# Altium project DM3390_R0M0E0.PrjPcb (part 3 of 5)

## Sheet DM3390_IMU.SchDoc: =project_title
size Tabloid; CompanyName: Luxonis Holding; DrawnBy: David Malovrh; Organization: Luxonis Holding; Address1: 1925 Harmony Park Drive; Address2: Westminster, CO; Address3: 80234; Address4: United States; DocumentNumber: D0000190; SheetNumber: 11; SheetTotal: 11
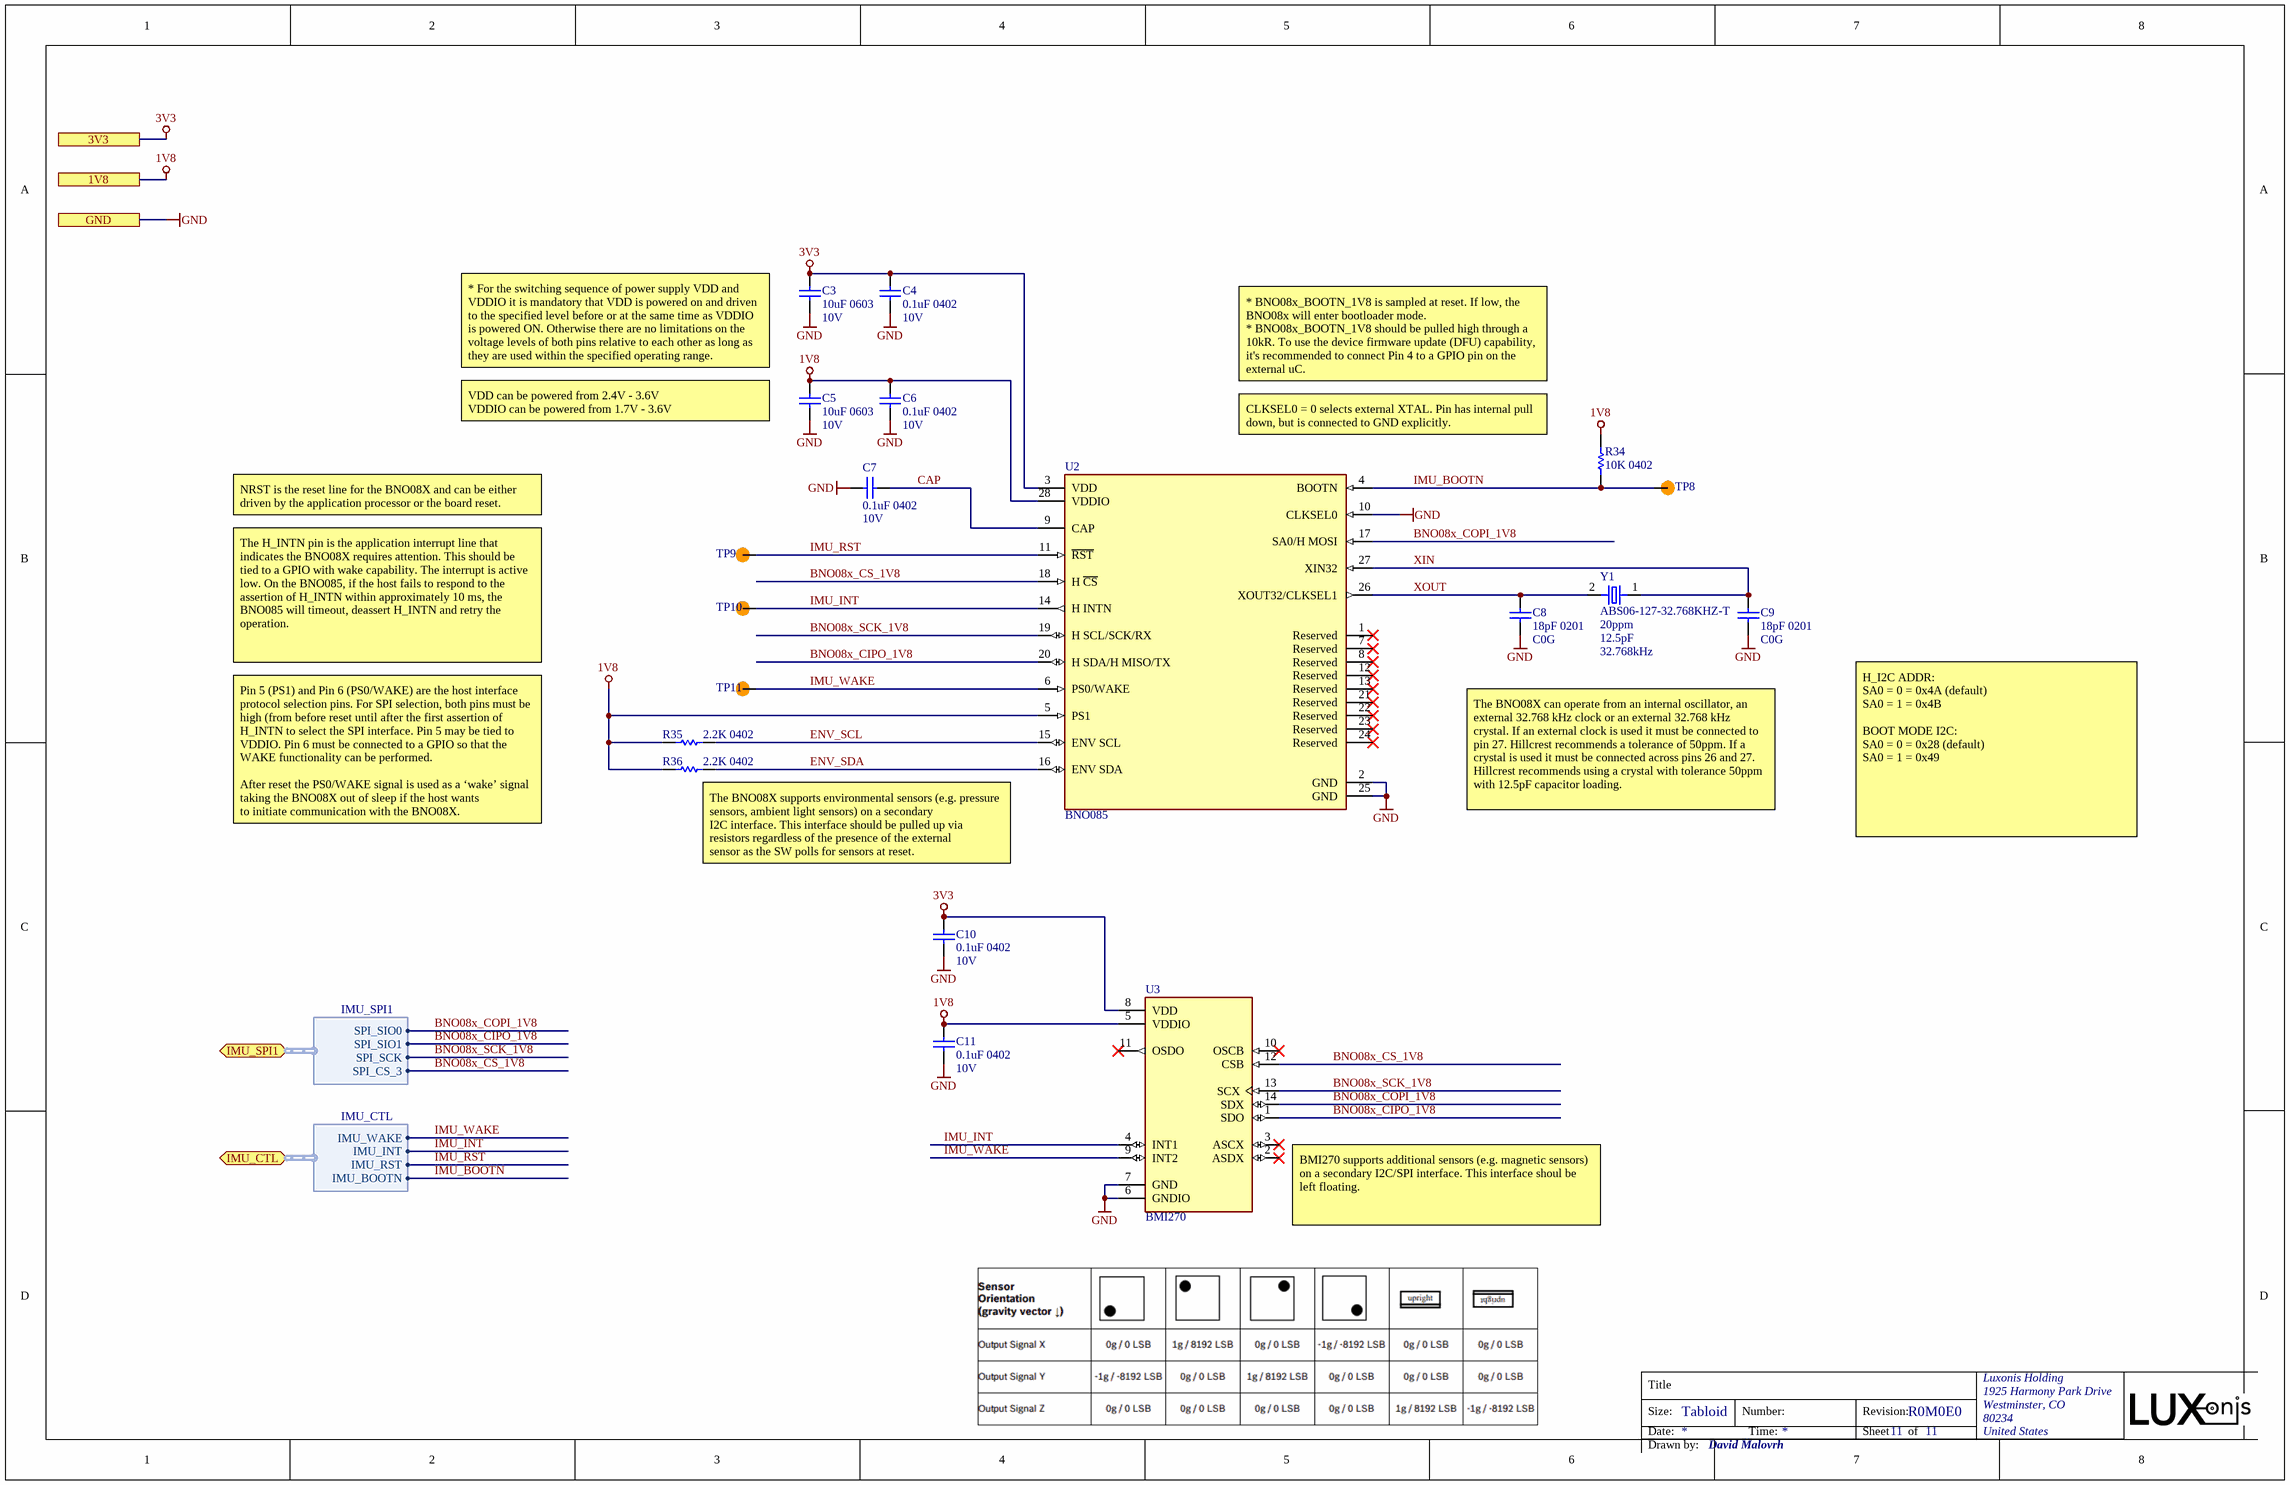
[diagram p4: DM3390_IMU.SchDoc]

### Parts
C3  10uF 0603  Voltage Rating: 10V  [CAPC0603(1608)100_L]
C4  0.1uF 0402  Voltage Rating: 10V  [CAPC0402(1005)70_L]
C5  10uF 0603  Voltage Rating: 10V  [CAPC0603(1608)100_L]
C6  0.1uF 0402  Voltage Rating: 10V  [CAPC0402(1005)70_L]
C7  0.1uF 0402  Voltage Rating: 10V  [CAPC0402(1005)70_L]
C8  18pF 0201  Dielectric: C0G  [CAPC0201(0603)33_L]
C9  18pF 0201  Dielectric: C0G  [CAPC0201(0603)33_L]
C10  0.1uF 0402  Voltage Rating: 10V  [CAPC0402(1005)70_L]
C11  0.1uF 0402  Voltage Rating: 10V  [CAPC0402(1005)70_L]
R34  10K 0402  [RESC0402(1005)_L]
R35  2.2K 0402  [RESC0402(1005)_L]
R36  2.2K 0402  [RESC0402(1005)_L]
TP8  TP100_200_NS  [TP100_200_NS]  (value not drawn)  (no BOM)
TP9  TP100_200_NS  [TP100_200_NS]  (value not drawn)  (no BOM)
TP10  TP100_200_NS  [TP100_200_NS]  (value not drawn)  (no BOM)
TP11  TP100_200_NS  [TP100_200_NS]  (value not drawn)  (no BOM)
U2  BNO085  [BNO085]
U3  BMI270  [XDCR_BMI270]
Y1  ABS06-127-32.768KHZ-T  Frequency Tolerance: 20ppm  Load Capacitance: 12.5pF  Frequency: 32.768kHz  [ABS06-127-32.768KHZ-T]

### Ports
1V8, 3V3, GND, IMU_CTL (bidir, harness IMU_CTL), IMU_SPI1 (bidir, harness IMU_SPI1)

### Harnesses
IMU_SPI1: SPI_SIO0, SPI_SIO1, SPI_CS_3, SPI_SCK
IMU_CTL: IMU_WAKE, IMU_INT, IMU_RST, IMU_BOOTN

### Nets
1V8: C5.2 C6.2 C11.2 R34.2 R35.1 R36.1 U2.5(PS1) U2.28(VDDIO) U3.5(VDDIO) ; port 1V8
3V3: C3.2 C4.2 C10.2 U2.3(VDD) U3.8(VDD) ; port 3V3
GND: C3.1 C4.1 C5.1 C6.1 C7.2 C8.1 C9.1 C10.1 C11.1 U2.2(GND) U2.10(CLKSEL0) U2.25(GND) U3.6(GNDIO) U3.7(GND) ; port GND
BNO08x_CIPO_1V8: U2.20(H_SDA/H_MISO/TX) U3.1(SDO) ; port IMU_SPI1.SPI_SIO1
BNO08x_COPI_1V8: U2.17(SA0/H_MOSI) U3.14(SDX) ; port IMU_SPI1.SPI_SIO0
BNO08x_CS_1V8: U2.18(H_~{CS}) U3.12(CSB) ; port IMU_SPI1.SPI_CS_3
BNO08x_SCK_1V8: U2.19(H_SCL/SCK/RX) U3.13(SCX) ; port IMU_SPI1.SPI_SCK
CAP: C7.1 U2.9(CAP)
ENV_SCL: R35.2 U2.15(ENV_SCL)
ENV_SDA: R36.2 U2.16(ENV_SDA)
IMU_BOOTN: R34.1 TP8.1 U2.4(BOOTN) ; port IMU_CTL.IMU_BOOTN
IMU_INT: TP10.1 U2.14(H_INTN) U3.4(INT1) ; port IMU_CTL.IMU_INT
IMU_RST: TP9.1 U2.11(~{RST}) ; port IMU_CTL.IMU_RST
IMU_WAKE: TP11.1 U2.6(PS0/WAKE) U3.9(INT2) ; port IMU_CTL.IMU_WAKE
XIN: C9.2 U2.27(XIN32) Y1.1
XOUT: C8.2 U2.26(XOUT32/CLKSEL1) Y1.2

Not connected (* = marked no-connect by the designer): U2 1(Reserved)* 7(Reserved)* 8(Reserved)* 12(Reserved)* 13(Reserved)* 21(Reserved)* 22(Reserved)* 23(Reserved)* 24(Reserved)*; U3 2(ASDX)* 3(ASCX)* 10(OSCB)* 11(OSDO)*

### Notes on the sheet
- * For the switching sequence of power supply VDD and VDDIO it is mandatory that VDD is powered on and driven to the specified level before or at the same time as VDDIO is powered ON. Otherwise there are no limitations on the voltage levels of both pins relative to each other as long as they are used within the specified operating range.
- (near C5) VDD can be powered from 2.4V - 3.6V
  VDDIO can be powered from 1.7V - 3.6V
- * BNO08x_BOOTN_1V8 is sampled at reset. If low, the BNO08x will enter bootloader mode.
  * BNO08x_BOOTN_1V8 should be pulled high through a 10kR. To use the device firmware update (DFU) capability, it's recommended to connect Pin 4 to a GPIO pin on the external uC.
- CLKSEL0 = 0 selects external XTAL. Pin has internal pull down, but is connected to GND explicitly.
- NRST is the reset line for the BNO08X and can be either driven by the application processor or the board reset.
- The H_INTN pin is the application interrupt line that indicates the BNO08X requires attention. This should be tied to a GPIO with wake capability. The interrupt is active low. On the BNO085, if the host fails to respond to the assertion of H_INTN within approximately 10 ms, the BNO085 will timeout, deassert H_INTN and retry the operation.
- Pin 5 (PS1) and Pin 6 (PS0/WAKE) are the host interface protocol selection pins. For SPI selection, both pins must be high (from before reset until after the first assertion of H_INTN to select the SPI interface. Pin 5 may be tied to VDDIO. Pin 6 must be connected to a GPIO so that the WAKE functionality can be performed.
  After reset the PS0/WAKE signal is used as a ‘wake’ signal taking the BNO08X out of sleep if the host wants
  to initiate communication with the BNO08X.
- The BNO08X can operate from an internal oscillator, an external 32.768 kHz clock or an external 32.768 kHz crystal. If an external clock is used it must be connected to pin 27. Hillcrest recommends a tolerance of 50ppm. If a crystal is used it must be connected across pins 26 and 27. Hillcrest recommends using a crystal with tolerance 50ppm with 12.5pF capacitor loading.
- H_I2C ADDR:
  SA0 = 0 = 0x4A (default)
  SA0 = 1 = 0x4B
  BOOT MODE I2C:
  SA0 = 0 = 0x28 (default)
  SA0 = 1 = 0x49
- (near R36) The BNO08X supports environmental sensors (e.g. pressure sensors, ambient light sensors) on a secondary
  I2C interface. This interface should be pulled up via resistors regardless of the presence of the external
  sensor as the SW polls for sensors at reset.
- (near U3) BMI270 supports additional sensors (e.g. magnetic sensors) on a secondary I2C/SPI interface. This interface shoul be left floating.
- Title
- Size:
- Date:
- Tabloid
- Number:
- Time:
- Revision:
- Sheet
- of
- Drawn by:

### Library data of the parts
C3 C5 = GRM188R61A106ME69D: CAP CER 10UF 10V X5R 0603 20%; Manufacturer 1: Murata; Material: Ceramic; Supplier 1: Digi-Key; Manufacturer Part Number 1: GRM188R61A106ME69D; Stock 1: 2873098; Pricing 1: 1=0.21000, 10=0.14100, 100=0.07130, 500=0.04876, 1000=0.04313 (USD); RoHS: Yes; Mount: Surface Mount; Case/Package: 0603; Weight: 0.000222oz; Case Code (Metric): 1608; Case Code (Imperial): 0603; Min Operating Temperature: -55°C; Max Operating Temperature: 85°C; Packaging: Tape and Reel; Tolerance: 20%; Capacitance: 10uF; Dielectric: X5R; Voltage Rating (DC): 10V; Package Quantity: 4000; Termination: SMD/SMT; Length: 1.6mm; Height: 0.8mm; Width: 0.8mm; Thickness: 0.035inch; Depth: 0.8mm; REACH SVHC: Unknown; Lead Free: Lead Free; ComponentLink1URL: http://www.mouser.com/ds/2/281/c02e-2905.pdf?src-supplier=Mouser; ComponentLink1Description: http://www.mouser.com/ds/2/281/c02e-2905.pdf?src-supplier=Mouser; ComponentLink2URL: http://components.arrow.com/part/dataview/0323_06119472?src-supplier=Arrow+Europe; ComponentLink2Description: http://components.arrow.com/part/dataview/0323_06119472?src-supplier=Arrow+Europe; ComponentLink3URL: http://www.farnell.com/datasheets/2048014.pdf?src-supplier=Farnell; ComponentLink3Description: http://www.farnell.com/datasheets/2048014.pdf?src-supplier=Farnell; ComponentLink4URL: http://www.farnell.com/datasheets/1872210.pdf?src-supplier=Farnell; ComponentLink4Description: http://www.farnell.com/datasheets/1872210.pdf?src-supplier=Farnell; ComponentLink5URL: http://search.murata.co.jp/Ceramy/image/img/A01X/G101/ENG/GRM188R61A106ME69-01.pdf?src-supplier=Digi-Key; ComponentLink5Description: http://search.murata.co.jp/Ceramy/image/img/A01X/G101/ENG/GRM188R61A106ME69-01.pdf?src-supplier=Digi-Key; ComponentLink6URL: http://www.farnell.com/datasheets/1872210.pdf?src-supplier=Newark; ComponentLink6Description: http://www.farnell.com/datasheets/1872210.pdf?src-supplier=Newark; ComponentLink7URL: http://www.farnell.com/datasheets/2048014.pdf?src-supplier=Element14; ComponentLink7Description: http://www.farnell.com/datasheets/2048014.pdf?src-supplier=Element14; ComponentLink8URL: http://www.farnell.com/datasheets/2048014.pdf?src-supplier=Newark; ComponentLink8Description: http://www.farnell.com/datasheets/2048014.pdf?src-supplier=Newark; Supplier Part Number 1: 490-10475-1-ND
C4 C6 C7 C10 C11 = GRM155R71A104JA01D: CAP CER 0.1UF 10V X7R 0402 5%; Manufacturer 1: Murata; Capacitance: 100nF; Supplier 1: Digi-Key; Manufacturer Part Number 1: GRM155R71A104JA01D; Stock 1: 1346709; Pricing 1: 1=0.10000, 10=0.02500, 100=0.01130, 500=0.00806, 1000=0.00633, 2500=0.00575, 5000=0.00529 (USD); RoHS: Yes; Mount: Surface Mount; Case/Package: 0402; Case Code (Imperial): 0402; Case Code (Metric): 1005; Min Operating Temperature: -55°C; Max Operating Temperature: 125°C; Tolerance: 5%; Packaging: Tape and Reel; Voltage Rating (DC): 10V; Dielectric: X7R; Package Quantity: 10000; Termination: SMD/SMT; Length: 1mm; Height: 0.5mm; Width: 0.02inch; Thickness: 0.022inch; Depth: 0.5mm; Radiation Hardening: No; Lead Free: Lead Free; ComponentLink1URL: https://datasheet.ciiva.com/5411/product-5411135.pdf?src-supplier=Mouser; ComponentLink1Description: https://datasheet.ciiva.com/5411/product-5411135.pdf?src-supplier=Mouser; ComponentLink2URL: https://datasheet.ciiva.com/11618/c02e-11618821.pdf?src-supplier=Avnet; ComponentLink2Description: https://datasheet.ciiva.com/11618/c02e-11618821.pdf?src-supplier=Avnet; Supplier Part Number 1: 490-10777-1-ND
C8 C9 = GRM0335C1E180FA01D: Cap Ceramic 18pF 25V C0G 1% Pad SMD 0201 125C T/R; Manufacturer 1: Murata; Supplier 1: Digi-Key; Manufacturer Part Number 1: GRM0335C1E180FA01D; RoHS: Yes; Category: Ceramic Capacitors; Stock 1: 27511; Pricing 1: 1=0.10000, 10=0.02100, 100=0.00930, 500=0.00666, 1000=0.00523, 2500=0.00476, 5000=0.00438 (USD); Mount: Surface Mount; Case/Package: 0201; Case Code (Imperial): 0201; Case Code (Metric): 0603; Min Operating Temperature: -55°C; Max Operating Temperature: 125°C; Capacitance: 18pF; Tolerance: 1%; Packaging: Tape and Reel; Voltage Rating (DC): 25V; Package Quantity: 15000; Voltage Rating: 25V; Termination: SMD/SMT; Length: 0.024inch; Height: 0.3mm; Thickness: 0.013inch; Width: 0.3mm; ComponentLink1URL: https://datasheet.ciiva.com/29538/partnumbering-e-01-29538328.pdf?src-supplier=Digi-Key; ComponentLink1Description: https://datasheet.ciiva.com/29538/partnumbering-e-01-29538328.pdf?src-supplier=Digi-Key; Supplier 2: Digi-Key; Supplier 3: Mouser; Supplier Part Number 3: 81-GRM0335C1E180FA1D; Supplier Part Number 2: 490-17804-2-ND; Supplier Part Number 1: 490-17804-1-ND
R34 = RC0402FR-1310KL: RES SMD 10K OHM 1% 0402 1/16W Chip Resistor, 0402 [1005 Metric], 10 kohm, RC Series, 50 V, Thick Film, 62.5 mW; Manufacturer 1: Yageo; Resistance: 10kR; Temperature Coefficient: 100ppm/°C; Power Rating: 62.5mW; Voltage Rating: 50V; ComponentLink1URL: https://datasheet.ciiva.com/16940/pyu-rc0402-51-rohs-l-6-16940293.pdf?src-supplier=Avnet+Europe; ComponentLink1Description: https://datasheet.ciiva.com/16940/pyu-rc0402-51-rohs-l-6-16940293.pdf?src-supplier=Avnet+Europe; ComponentLink2URL: https://datasheet.ciiva.com/28386/pyu-rc0402-51-rohs-l-6-28386855.pdf?src-supplier=Avnet+Europe; ComponentLink2Description: https://datasheet.ciiva.com/28386/pyu-rc0402-51-rohs-l-6-28386855.pdf?src-supplier=Avnet+Europe; ComponentLink3URL: https://datasheet.ciiva.com/16740/pyu-rc0402-51-rohs-l-6-r-16740602.pdf?src-supplier=Future+Electronics; ComponentLink3Description: https://datasheet.ciiva.com/16740/pyu-rc0402-51-rohs-l-6-r-16740602.pdf?src-supplier=Future+Electronics; ComponentLink4URL: https://datasheet.ciiva.com/8891/pyu-rc0402-51-rohs-l-6-8891339.pdf?src-supplier=Avnet; ComponentLink4Description: https://datasheet.ciiva.com/8891/pyu-rc0402-51-rohs-l-6-8891339.pdf?src-supplier=Avnet; ComponentLink5URL: https://datasheet.ciiva.com/5557/pyu-rc0402-51-rohs-l-6-r-5557997.pdf?src-supplier=Mouser; ComponentLink5Description: https://datasheet.ciiva.com/5557/pyu-rc0402-51-rohs-l-6-r-5557997.pdf?src-supplier=Mouser; ComponentLink6URL: https://datasheet.ciiva.com/7983/1018594-7983533.pdf?src-supplier=Element14; ComponentLink6Description: https://datasheet.ciiva.com/7983/1018594-7983533.pdf?src-supplier=Element14; Supplier 1: Newark; Manufacturer Part Number 1: RC0402FR-1310KL; Stock 1: 62239; Pricing 1: 1=0.10000, 25=0.01200, 100=0.00400, 250=0.00400, 500=0.00300, 1000=0.00300 (USD); RoHS: Yes; Case/Package: 0402; Number of Pins: 2; Contact Plating: Tin,Matte,Lead; Case Code (Imperial): 0402; Case Code (Metric): 1005; Min Operating Temperature: -55°C; Max Operating Temperature: 155°C; Tolerance: 1%; Composition: Thick Film; Packaging: Tape and Reel; Termination: SMD/SMT; Military Standard: Not; Voltage Rating (DC): 50V; Working Voltage: 50V; Number of Terminations: 2; Length: 1mm; Depth: 0.5mm; Radiation Hardening: No; REACH SVHC: No SVHC; Lead Free: Lead Free; Supplier Part Number 1: 67R9960; Supplier 2: Future Electronics; Supplier 3: Mouser; Supplier 4: Element14; Supplier Part Number 2: RC0402FR-1310KL-CUTT; Supplier Part Number 3: 603-RC0402FR-1310KL; Supplier Part Number 4: 1799235
R35 R36 = RC0402FR-072K2L: RES SMD 2.2K OHM 1% 1/16W 0402; Manufacturer 1: Yageo; Resistance: 2.2kR; Temperature Coefficient: 100ppm/°C; Power Rating: 63mW; Voltage Rating: 50V; Supplier 1: Digi-Key; Manufacturer Part Number 1: RC0402FR-072K2L; Stock 1: 12579098; Pricing 1: 1=0.10000, 10=0.01600, 100=0.00640, 1000=0.00289, 2500=0.00251, 5000=0.00207 (USD); RoHS: Yes; Case/Package: 0402; Weight: 2.3E-05oz; Case Code (Imperial): 0402; Case Code (Metric): 1005; Min Operating Temperature: -55°C; Max Operating Temperature: 155°C; Packaging: Tape and Reel; Tolerance: 1%; Composition: Thick Film; Termination: SMD/SMT; Military Standard: Not; Length: 1mm; Height: 0.35mm; Width: 0.5mm; Depth: 0.5mm; Lead Free: Lead Free; REACH SVHC: Unknown; ComponentLink1URL: https://datasheet.ciiva.com/11808/0900766b80c66297-11808786.pdf?src-supplier=RSComponents; ComponentLink1Description: https://datasheet.ciiva.com/11808/0900766b80c66297-11808786.pdf?src-supplier=RSComponents; ComponentLink2URL: https://datasheet.ciiva.com/12577/pyu-rc0402-51-rohs-l-6-r-12577429.pdf?src-supplier=Mouser; ComponentLink2Description: https://datasheet.ciiva.com/12577/pyu-rc0402-51-rohs-l-6-r-12577429.pdf?src-supplier=Mouser; ComponentLink3URL: https://datasheet.ciiva.com/16741/pyu-rc0402-51-rohs-l-6-r-16741015.pdf?src-supplier=Future+Electronics; ComponentLink3Description: https://datasheet.ciiva.com/16741/pyu-rc0402-51-rohs-l-6-r-16741015.pdf?src-supplier=Future+Electronics; ComponentLink4URL: https://datasheet.ciiva.com/7983/1018594-7983515.pdf?src-supplier=Element14; ComponentLink4Description: https://datasheet.ciiva.com/7983/1018594-7983515.pdf?src-supplier=Element14; ComponentLink5URL: https://datasheet.ciiva.com/46383/1018594-46383563.pdf?src-supplier=Element14; ComponentLink5Description: https://datasheet.ciiva.com/46383/1018594-46383563.pdf?src-supplier=Element14; ComponentLink6URL: https://datasheet.ciiva.com/7849/1018594-7849928.pdf?src-supplier=Element14; ComponentLink6Description: https://datasheet.ciiva.com/7849/1018594-7849928.pdf?src-supplier=Element14; ComponentLink7URL: https://datasheet.ciiva.com/7849/1018594-7849929.pdf?src-supplier=Element14; ComponentLink7Description: https://datasheet.ciiva.com/7849/1018594-7849929.pdf?src-supplier=Element14; Supplier 2: Mouser; Supplier 3: Newark; Supplier Part Number 1: 311-2.20KLRCT-ND; Supplier Part Number 2: 603-RC0402FR-072K2L; Supplier Part Number 3: 98K7523
TP8-TP11 = TEST_POINT
U2 = BNO085: IMU ACCEL/GYRO/MAG I2C 32BIT; Manufacturer 1: Hillcrest Laboratories; Sensor Type: Accelerometer,Gyroscope,Magnetometer; Output Type: SPI,I2C; Supplier 1: Digi-Key; Manufacturer Part Number 1: BNO085; RoHS: No; Category: Inertial Measurement Units (IMUs); Stock 1: 11593; Pricing 1: 1=11.85000, 5=10.31200, 10=9.28100, 25=8.25000, 50=7.63120, 100=6.60000, 500=6.18750, 1000=5.77500 (USD); Mount: Surface Mount; Case/Package: LGA; Min Operating Temperature: -40°C; Max Operating Temperature: 85°C; Packaging: Tape and Reel; ComponentLink1URL: https://www.hillcrestlabs.com/downloads/bno080-datasheet?src-supplier=Digi-Key; ComponentLink1Description: https://www.hillcrestlabs.com/downloads/bno080-datasheet?src-supplier=Digi-Key; ComponentLink2URL: https://www.hillcrestlabs.com/downloads/bno080-migration-guide?src-supplier=Digi-Key; ComponentLink2Description: https://www.hillcrestlabs.com/downloads/bno080-migration-guide?src-supplier=Digi-Key; Supplier Part Number 1: 1888-1006-1-ND
U3 = BMI270: Accelerometer, Gyroscope, 6 Axis Sensor IÂ²C, SPI Output; Manufacturer 1: Bosch Sensortec; Price: None; SnapEDA_Link: https://www.snapeda.com/parts/BMI270/Bosch%20Sensortec/view-part/3595167/?ref=snap; Manufacturer Part Number 1: BMI270; Availability: Unavailable; Value: *; Package: LGA-14 Bosch Sensortec
Y1 = ABS06-127-32.768KHZ-T: CRYSTAL 32.768kHz ±20ppm Crystal 12.5pF 90 kOhms 2-SMD, No Lead; Manufacturer 1: Abracon; ESR (Equivalent Series Resistance): 90kR; Supplier 1: Digi-Key; Manufacturer Part Number 1: ABS06-127-32.768KHZ-T; RoHS: Yes; Stock 1: 1640; Pricing 1: 1=0.69000, 10=0.60700, 50=0.56760, 100=0.50160, 500=0.47520, 1000=0.39600 (USD); Mount: Surface Mount; Case/Package: SMD/SMT; Min Operating Temperature: -40°C; Max Operating Temperature: 85°C; Packaging: Tape and Reel; ComponentLink1URL: http://www.farnell.com/datasheets/2614114.pdf?src-supplier=Farnell; ComponentLink1Description: http://www.farnell.com/datasheets/2614114.pdf?src-supplier=Farnell; ComponentLink2URL: https://abracon.com/datasheets/ABS06-127-32.768kHz-T.pdf?src-supplier=Digi-Key; ComponentLink2Description: https://abracon.com/datasheets/ABS06-127-32.768kHz-T.pdf?src-supplier=Digi-Key; ComponentLink3URL: http://www.farnell.com/datasheets/2614114.pdf?src-supplier=Newark; ComponentLink3Description: http://www.farnell.com/datasheets/2614114.pdf?src-supplier=Newark; Supplier 2: Digi-Key; Supplier 3: Mouser; Supplier 4: Verical; Supplier Part Number 1: 535-14513-1-ND; Supplier Part Number 2: 535-14513-6-ND; Supplier Part Number 3: 815-ABS0612732.768KT; Supplier Part Number 4: ABS06-127-32.768KHZ-T

## Sheet DM3390_BOOT_JTAG_SD.SchDoc: =project_title
size Tabloid; CompanyName: Luxonis Holding; DrawnBy: David Malovrh; Organization: Luxonis Holding; Address1: 1925 Harmony Park Drive; Address2: Westminster, CO; Address3: 80234; Address4: United States; DocumentNumber: D0000190; SheetNumber: 6; SheetTotal: 12
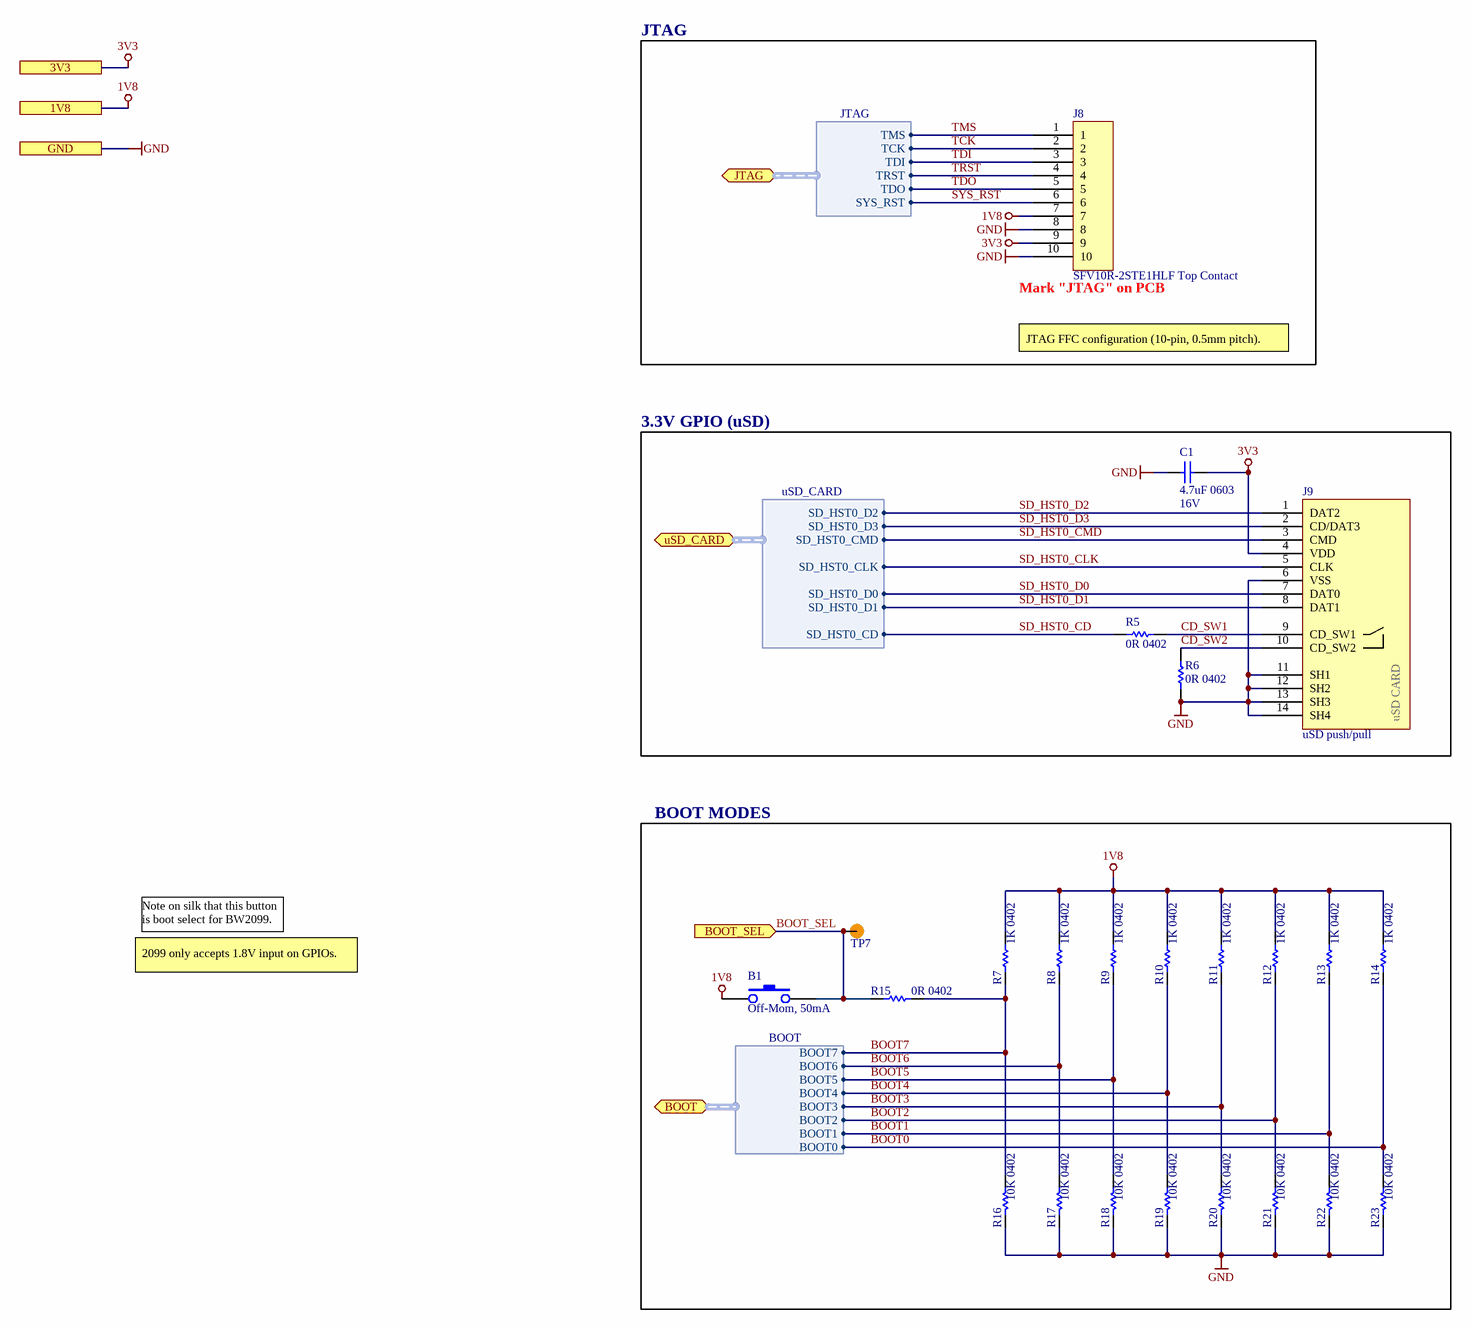
[diagram p5: DM3390_BOOT_JTAG_SD.SchDoc]

### Parts
B1  Off-Mom, 50mA  [DTSM-32N-V]
C1  4.7uF 0603  Voltage Rating: 16V  [CAPC0603(1608)100_N]
J8  SFV10R-2STE1HLF Top Contact  [SFV10R-2STE1HLF]
J9  uSD push/pull  [104031-0811]
R5  0R 0402  [RESC0402(1005)_N]
R6  0R 0402  [RESC0402(1005)_N]
R7  1K 0402  [RESC0402(1005)_L]
R8  1K 0402  [RESC0402(1005)_L]
R9  1K 0402  [RESC0402(1005)_L]
R10  1K 0402  [RESC0402(1005)_L]
R11  1K 0402  [RESC0402(1005)_L]
R12  1K 0402  [RESC0402(1005)_L]
R13  1K 0402  [RESC0402(1005)_L]
R14  1K 0402  [RESC0402(1005)_L]
R15  0R 0402  [RESC0402(1005)_L]
R16  10K 0402  [RESC0402(1005)_L]
R17  10K 0402  [RESC0402(1005)_L]
R18  10K 0402  [RESC0402(1005)_L]
R19  10K 0402  [RESC0402(1005)_L]
R20  10K 0402  [RESC0402(1005)_L]
R21  10K 0402  [RESC0402(1005)_L]
R22  10K 0402  [RESC0402(1005)_L]
R23  10K 0402  [RESC0402(1005)_L]
TP7  TP100_200_NS  [TP100_200_NS]  (value not drawn)  (no BOM)

### Blocks framed on the sheet
JTAG: J8
3.3V GPIO (uSD): C1 J9 R5 R6
BOOT MODES: B1 R7-R23 TP7

### Ports
1V8, 3V3, BOOT (bidir, harness BOOT), BOOT_SEL (in), GND, JTAG (bidir, harness JTAG), uSD_CARD (bidir, harness uSD_CARD)

### Harnesses
JTAG: SYS_RST, TDO, TRST, TDI, TCK, TMS
uSD_CARD: SD_HST0_CLK, SD_HST0_CMD, SD_HST0_D0, SD_HST0_D1, SD_HST0_D2, SD_HST0_D3, SD_HST0_CD
BOOT: BOOT4, BOOT3, BOOT2, BOOT1, BOOT0, BOOT5, BOOT6, BOOT7

### Nets
1V8: B1.1 J8.7 R7.2 R8.2 R9.2 R10.2 R11.2 R12.2 R13.2 R14.2 ; port 1V8
3V3: C1.2 J8.9 J9.4(VDD) ; port 3V3
GND: C1.1 J8.8 J8.10 J9.6(VSS) J9.11(SH1) J9.12(SH2) J9.13(SH3) J9.14(SH4) R6.1 R16.2 R17.2 R18.2 R19.2 R20.2 R21.2 R22.2 R23.2 ; port GND
BOOT0: R14.1 R23.1 ; port BOOT.BOOT0
BOOT1: R13.1 R22.1 ; port BOOT.BOOT1
BOOT2: R12.1 R21.1 ; port BOOT.BOOT2
BOOT3: R11.1 R20.1 ; port BOOT.BOOT3
BOOT4: R10.1 R19.1 ; port BOOT.BOOT4
BOOT5: R9.1 R18.1 ; port BOOT.BOOT5
BOOT6: R8.1 R17.1 ; port BOOT.BOOT6
BOOT7: R7.1 R15.1 R16.1 ; port BOOT.BOOT7
BOOT_SEL: B1.2 R15.2 TP7.1 ; port BOOT_SEL
CD_SW1: J9.9(CD_SW1) R5.1
CD_SW2: J9.10(CD_SW2) R6.2
SD_HST0_CD: R5.2 ; port uSD_CARD.SD_HST0_CD
SD_HST0_CLK: J9.5(CLK) ; port uSD_CARD.SD_HST0_CLK
SD_HST0_CMD: J9.3(CMD) ; port uSD_CARD.SD_HST0_CMD
SD_HST0_D0: J9.7(DAT0) ; port uSD_CARD.SD_HST0_D0
SD_HST0_D1: J9.8(DAT1) ; port uSD_CARD.SD_HST0_D1
SD_HST0_D2: J9.1(DAT2) ; port uSD_CARD.SD_HST0_D2
SD_HST0_D3: J9.2(CD/DAT3) ; port uSD_CARD.SD_HST0_D3
SYS_RST: J8.6 ; port JTAG.SYS_RST  [project net SYS_nRST]
TCK: J8.2 ; port JTAG.TCK
TDI: J8.3 ; port JTAG.TDI
TDO: J8.5 ; port JTAG.TDO
TMS: J8.1 ; port JTAG.TMS
TRST: J8.4 ; port JTAG.TRST

### Notes on the sheet
- (near J8) Mark "JTAG" on PCB
- JTAG FFC configuration (10-pin, 0.5mm pitch).
- 2099 only accepts 1.8V input on GPIOs.
- Note on silk that this button is boot select for BW2099.
- Title
- Size:
- Date:
- Tabloid
- Number:
- Time:
- Revision:
- Sheet
- of
- Drawn by:
- (in symbol 104031-0811) uSD CARD

### Library data of the parts
B1 = DTSM-32N-V: SWITCH TACTILE SMT 3.5mm * 6mm , brown 160gf; Manufacturer 1: Diptronics; Manufacturer Part Number 1: DTSM-32N-V-T/R; Supplier 1: Mouser; Stock 1: 3199; Pricing 1: 1=0.38000, 10=0.38000, 50=0.31000, 100=0.28200, 500=0.25600, 1000=0.23600, 1600=0.20900, 4800=0.18800, 9600=0.17300, 10000=0.17300, 24000=0.16100 (USD); RoHS: Yes; Min Operating Temperature: -30°C; Max Operating Temperature: 80°C; Length: 6mm; Height: 5mm; Width: 3.5mm; ComponentLink1URL: https://datasheet.ciiva.com/29188/708548-da-01-en-tastschalter-smd-dtsm-32n-v-tr-1600st-29188823.pdf?src-supplier=Conrad; ComponentLink1Description: https://datasheet.ciiva.com/29188/708548-da-01-en-tastschalter-smd-dtsm-32n-v-tr-1600st-29188823.pdf?src-supplier=Conrad; Supplier Part Number 1: 113-DTSM32NVTR
C1 = GRM188R61C475KAAJD: CAP CER 4.7UF 16V X5R 0603 10%; Manufacturer 1: Murata; Material: Ceramic; Manufacturer Part Number 1: GRM188R61C475KAAJD; Supplier 1: Digi-Key; Stock 1: 455058; Pricing 1: 1=0.35000, 10=0.24600, 100=0.14730, 500=0.11050, 1000=0.09331 (USD); RoHS: Yes; Mount: Surface Mount; Case/Package: 0603; Weight: 0.000222oz; Case Code (Metric): 1608; Case Code (Imperial): 0603; Min Operating Temperature: -55°C; Max Operating Temperature: 85°C; Capacitance: 4.7uF; Tolerance: 10%; Packaging: Tape and Reel; Dielectric: X5R; Termination: SMD/SMT; Voltage Rating (DC): 16V; Package Quantity: 4000; Length: 1.6mm; Height: 0.8mm; Width: 0.8mm; Thickness: 0.037inch; Depth: 0.8mm; REACH SVHC: No SVHC; Lead Free: Lead Free; ComponentLink1URL: https://datasheet.ciiva.com/14813/595grm188r61c475kaaj23-14813668.pdf?src-supplier=Arrow; ComponentLink1Description: https://datasheet.ciiva.com/14813/595grm188r61c475kaaj23-14813668.pdf?src-supplier=Arrow; Supplier 2: Digi-Key; Manufacturer 2: Murata; Manufacturer Part Number 2: GRM188R61C475KAAJD; Stock 2: 455058; Pricing 2: 1=0.35000, 10=0.24600, 100=0.14730, 500=0.11050, 1000=0.09331 (USD); Supplier 3: Digi-Key; Manufacturer 3: Murata; Manufacturer Part Number 3: GRM188R61C475KAAJD; Stock 3: 452000; Pricing 3: 4000=0.07259, 8000=0.06832, 12000=0.06619, 28000=0.06405 (USD); Supplier Part Number 1: 490-10481-1-ND; Supplier Part Number 2: 490-10481-6-ND; Supplier Part Number 3: 490-10481-2-ND
J8 = SFV10R-2STE1HLF: CONN FFC TOP 10POS 0.50MM R/A; Manufacturer 1: Amphenol FCI; Actuator Material: Glass,Polyphenylene; Number of Contacts: 10; Current Rating: 500mA; Voltage Rating: 50V; Contact Resistance: 30mR; Insulation Resistance: 100MR; Gender: Female; Wire/Cable Type: Straight; Pitch: 0.5mm; System: Connector; Supplier 1: Digi-Key; Manufacturer Part Number 1: SFV10R-2STE1HLF; Stock 1: 78727; Pricing 1: 1=0.63000, 10=0.59300, 25=0.53360, 50=0.47420, 100=0.45440, 250=0.41488, 500=0.39512, 1000=0.32597 (USD); RoHS: Yes; Mount: Surface Mount; Contact Material: Bronze; Contact Plating: Tin; Housing Color: Black; Housing Material: Polyamide; Min Operating Temperature: -55°C; Max Operating Temperature: 105°C; Number of Rows: 1; Termination: Solder; Orientation: Right Angle; Package Quantity: 1; Packaging: Tape and Reel; Contact Location: Top; Number of Positions: 10; Max Voltage Rating (AC): 50V; Max Voltage Rating (DC): 50V; Length: 10.5mm; Depth: 4.9mm; Radiation Hardening: No; Lead Free: Lead Free; Flammability Rating: UL94 V-0; ComponentLink1URL: https://datasheet.ciiva.com/672/10112793-672039.pdf?src-supplier=Digi-Key; ComponentLink1Description: https://datasheet.ciiva.com/672/10112793-672039.pdf?src-supplier=Digi-Key; ComponentLink2URL: https://datasheet.ciiva.com/672/10112793-672040.pdf?src-supplier=Digi-Key; ComponentLink2Description: https://datasheet.ciiva.com/672/10112793-672040.pdf?src-supplier=Digi-Key; ComponentLink3URL: https://datasheet.ciiva.com/672/10112793-672041.pdf?src-supplier=Digi-Key; ComponentLink3Description: https://datasheet.ciiva.com/672/10112793-672041.pdf?src-supplier=Digi-Key; ComponentLink4URL: https://datasheet.ciiva.com/10368/10112793-10368361.pdf?src-supplier=Avnet; ComponentLink4Description: https://datasheet.ciiva.com/10368/10112793-10368361.pdf?src-supplier=Avnet; Supplier Part Number 1: 609-4306-1-ND; Supplier 2: Mouser; Supplier Part Number 2: 649-SFV10R-2STE1HLF
J9 = 104031-0811: CONN MICRO SD CARD PUSH-PULL R/A; Manufacturer 1: Molex; Manufacturer Part Number 1: 104031-0811; Supplier 1: Digi-Key; Stock 1: 19400; Pricing 1: 1=2.02000, 10=1.82900, 25=1.71680, 50=1.64220, 100=1.56760, 250=1.41828, 500=1.30630, 1000=1.11969 (USD); RoHS: No; Supplier 2: Newark; Supplier 3: Mouser; Supplier Part Number 1: WM6357CT-ND; Supplier Part Number 2: 99R5410; Supplier Part Number 3: 538-104031-0811
R5 R6 R15 = CRCW04020000Z0ED: RES SMD 0 OHM JUMPER 1/16W 0402; Manufacturer 1: Vishay; Resistance: 0mR; Power Rating: 63mW; Voltage Rating: 50V; Temperature Coefficient: 100ppm/°C; Tolerance: 5%; Manufacturer Part Number 1: CRCW04020000Z0ED; Supplier 1: Digi-Key; Stock 1: 855968; Pricing 1: 1=0.10000, 10=0.03400, 25=0.02440, 50=0.01860, 100=0.01380, 250=0.01048, 500=0.00840, 1000=0.00618, 5000=0.00443 (USD); RoHS: Yes; Mount: Surface Mount; Case/Package: 0402; Weight: 2.3E-05oz; Case Code (Imperial): 0402; Case Code (Metric): 1005; Contact Plating: Tin; Min Operating Temperature: -55°C; Max Operating Temperature: 155°C; Packaging: Tape and Reel; Composition: Thick Film; Voltage Rating (DC): 50V; Package Quantity: 1; Termination: SMD/SMT; Number of Terminations: 2; Military Standard: Not; Max Power Dissipation: 63mW; Features: Automotive AEC-Q200; Length: 1mm; Height: 0.35mm; Width: 0.5mm; Depth: 0.5mm; Radiation Hardening: No; REACH SVHC: Unknown; Lead Free: Lead Free; ComponentLink1URL: https://datasheet.ciiva.com/3255/dcrcwe3-3255944.pdf?src-supplier=Avnet; ComponentLink1Description: https://datasheet.ciiva.com/3255/dcrcwe3-3255944.pdf?src-supplier=Avnet; ComponentLink2URL: https://datasheet.ciiva.com/3255/dcrcwe3-3255945.pdf?src-supplier=Avnet; ComponentLink2Description: https://datasheet.ciiva.com/3255/dcrcwe3-3255945.pdf?src-supplier=Avnet; ComponentLink3URL: https://datasheet.ciiva.com/16881/dcrcwe3-16881413.pdf?src-supplier=Avnet+Europe; ComponentLink3Description: https://datasheet.ciiva.com/16881/dcrcwe3-16881413.pdf?src-supplier=Avnet+Europe; ComponentLink4URL: https://datasheet.ciiva.com/2461/dcrcwe3-2461962.pdf?src-supplier=Digi-Key; ComponentLink4Description: https://datasheet.ciiva.com/2461/dcrcwe3-2461962.pdf?src-supplier=Digi-Key; ComponentLink5URL: https://datasheet.ciiva.com/7841/1720486-7841802.pdf?src-supplier=Element14; ComponentLink5Description: https://datasheet.ciiva.com/7841/1720486-7841802.pdf?src-supplier=Element14; ComponentLink6URL: https://datasheet.ciiva.com/2461/dcrcwe3-2461963.pdf?src-supplier=Digi-Key; ComponentLink6Description: https://datasheet.ciiva.com/2461/dcrcwe3-2461963.pdf?src-supplier=Digi-Key; ComponentLink7URL: https://datasheet.ciiva.com/2461/dcrcwe3-2461964.pdf?src-supplier=Digi-Key; ComponentLink7Description: https://datasheet.ciiva.com/2461/dcrcwe3-2461964.pdf?src-supplier=Digi-Key; ComponentLink8URL: https://datasheet.ciiva.com/7841/1697337-7841468.pdf?src-supplier=Element14; ComponentLink8Description: https://datasheet.ciiva.com/7841/1697337-7841468.pdf?src-supplier=Element14; ComponentLink9URL: https://datasheet.ciiva.com/16761/70200976-16761309.pdf?src-supplier=Allied+Electronics; ComponentLink9Description: https://datasheet.ciiva.com/16761/70200976-16761309.pdf?src-supplier=Allied+Electronics; ComponentLink10URL: https://datasheet.ciiva.com/26311/fld-crcw-e3-data-en-26311550.pdf?src-supplier=Distrelec; ComponentLink10Description: https://datasheet.ciiva.com/26311/fld-crcw-e3-data-en-26311550.pdf?src-supplier=Distrelec; Supplier Part Number 1: 541-0.0JCT-ND
R7-R14 = RC0402FR-071KL: RES SMD 1K OHM 1% 1/16W 0402 1 kOhms ±1% 0.063W, 1/16W Chip Resistor 0402 (1005 Metric) Moisture Resistant Thick Film; Manufacturer 1: Yageo; Temperature Coefficient: 100ppm/°C; Power Rating: 62.5mW; Voltage Rating (DC): 50V; Resistance: 1kR; RoHS: Yes; Number of Pins: 2; Case Code (Imperial): 0402; Case Code (Metric): 1005; Min Operating Temperature: -55°C; Max Operating Temperature: 155°C; Packaging: Tape and Reel; Composition: Thick Film; Voltage Rating: 50V; Military Standard: Not; Termination: SMD/SMT; Length: 1mm; Height: 0.32mm; Width: 0.5mm; Depth: 0.5mm; Lead Free: Lead Free; REACH SVHC: Unknown; ComponentLink1URL: https://datasheet.ciiva.com/11819/0900766b80c66297-11819477.pdf?src-supplier=RSComponents; ComponentLink1Description: https://datasheet.ciiva.com/11819/0900766b80c66297-11819477.pdf?src-supplier=RSComponents; ComponentLink2URL: https://datasheet.ciiva.com/12666/pyu-rc0402-51-rohs-l-6-r-12666741.pdf?src-supplier=Mouser; ComponentLink2Description: https://datasheet.ciiva.com/12666/pyu-rc0402-51-rohs-l-6-r-12666741.pdf?src-supplier=Mouser; ComponentLink3URL: https://datasheet.ciiva.com/17063/pyu-rc0402-51-rohs-l-6-r-17063193.pdf?src-supplier=Future+Electronics; ComponentLink3Description: https://datasheet.ciiva.com/17063/pyu-rc0402-51-rohs-l-6-r-17063193.pdf?src-supplier=Future+Electronics; ComponentLink4URL: https://datasheet.ciiva.com/22747/1018594-22747513.pdf?src-supplier=Element14; ComponentLink4Description: https://datasheet.ciiva.com/22747/1018594-22747513.pdf?src-supplier=Element14; ComponentLink5URL: https://datasheet.ciiva.com/7849/1018594-7849869.pdf?src-supplier=Element14; ComponentLink5Description: https://datasheet.ciiva.com/7849/1018594-7849869.pdf?src-supplier=Element14; ComponentLink6URL: https://datasheet.ciiva.com/7983/1018594-7983502.pdf?src-supplier=Element14; ComponentLink6Description: https://datasheet.ciiva.com/7983/1018594-7983502.pdf?src-supplier=Element14; ComponentLink7URL: https://datasheet.ciiva.com/7849/1018594-7849871.pdf?src-supplier=Element14; ComponentLink7Description: https://datasheet.ciiva.com/7849/1018594-7849871.pdf?src-supplier=Element14; Supplier 1: Digi-Key; Manufacturer Part Number 1: RC0402FR-071KL; Stock 1: 60695854; Pricing 1: 1=0.10000, 10=0.01600, 100=0.00670, 1000=0.00301, 2500=0.00261, 5000=0.00215 (USD); Case/Package: 0402; Tolerance: 1%; Supplier Part Number 1: 311-1.00KLRCT-ND
R16-R23 = RC0402FR-1310KL: as R34 on sheet DM3390_IMU; ComponentLink1URL: https://datasheet.ciiva.com/16940/pyu-rc0402-51-rohs-l-6-16940293.pdf?src-supplier=Avnet+Europe; ComponentLink1Description: https://datasheet.ciiva.com/16940/pyu-rc0402-51-rohs-l-6-16940293.pdf?src-supplier=Avnet+Europe; ComponentLink2URL: https://datasheet.ciiva.com/28386/pyu-rc0402-51-rohs-l-6-28386855.pdf?src-supplier=Avnet+Europe; ComponentLink2Description: https://datasheet.ciiva.com/28386/pyu-rc0402-51-rohs-l-6-28386855.pdf?src-supplier=Avnet+Europe; ComponentLink3URL: https://datasheet.ciiva.com/16740/pyu-rc0402-51-rohs-l-6-r-16740602.pdf?src-supplier=Future+Electronics; ComponentLink3Description: https://datasheet.ciiva.com/16740/pyu-rc0402-51-rohs-l-6-r-16740602.pdf?src-supplier=Future+Electronics; ComponentLink4URL: https://datasheet.ciiva.com/8891/pyu-rc0402-51-rohs-l-6-8891339.pdf?src-supplier=Avnet; ComponentLink4Description: https://datasheet.ciiva.com/8891/pyu-rc0402-51-rohs-l-6-8891339.pdf?src-supplier=Avnet; ComponentLink5URL: https://datasheet.ciiva.com/5557/pyu-rc0402-51-rohs-l-6-r-5557997.pdf?src-supplier=Mouser; ComponentLink5Description: https://datasheet.ciiva.com/5557/pyu-rc0402-51-rohs-l-6-r-5557997.pdf?src-supplier=Mouser; ComponentLink6URL: https://datasheet.ciiva.com/7983/1018594-7983533.pdf?src-supplier=Element14; ComponentLink6Description: https://datasheet.ciiva.com/7983/1018594-7983533.pdf?src-supplier=Element14; Supplier 1: Newark; Manufacturer Part Number 1: RC0402FR-1310KL; Stock 1: 62239; Pricing 1: 1=0.10000, 25=0.01200, 100=0.00400, 250=0.00400, 500=0.00300, 1000=0.00300 (USD); RoHS: Yes; Case/Package: 0402; Number of Pins: 2; Contact Plating: Tin,Matte,Lead; Case Code (Imperial): 0402; Case Code (Metric): 1005; Min Operating Temperature: -55°C; Max Operating Temperature: 155°C; Tolerance: 1%; Composition: Thick Film; Packaging: Tape and Reel; Termination: SMD/SMT; Military Standard: Not; Voltage Rating (DC): 50V; Working Voltage: 50V; Number of Terminations: 2; Length: 1mm; Depth: 0.5mm; Radiation Hardening: No; REACH SVHC: No SVHC; Lead Free: Lead Free; Supplier Part Number 1: 67R9960
TP7 = TEST_POINT

## Sheet DM3390_CAM_FFC_ESD_AUX.SchDoc: =project_title
size Tabloid; PageSetup: Record=PageOptions|CenterHorizontal=True|CenterVertical=True|PrintScale=0.73|XCorrection=1.00|YCorrection=1.00|PrintKind=0|BorderSize=5000000|LeftOffset=0|BottomOffset=0|Orientation=2|PaperLength=1000|PaperWidth=1000|Scale=100|PaperSource=7|PrintQuality=-4|MediaType=1|DitherType=10|PaperKind=A4|PrintScaleMode=1; CompanyName: Luxonis Holding; DrawnBy: David Malovrh; Organization: Luxonis Holding; Address1: 1925 Harmony Park Drive; Address2: Westminster, CO; Address3: 80234; Address4: United States; DocumentNumber: D0000190; SheetNumber: 5; SheetTotal: 12
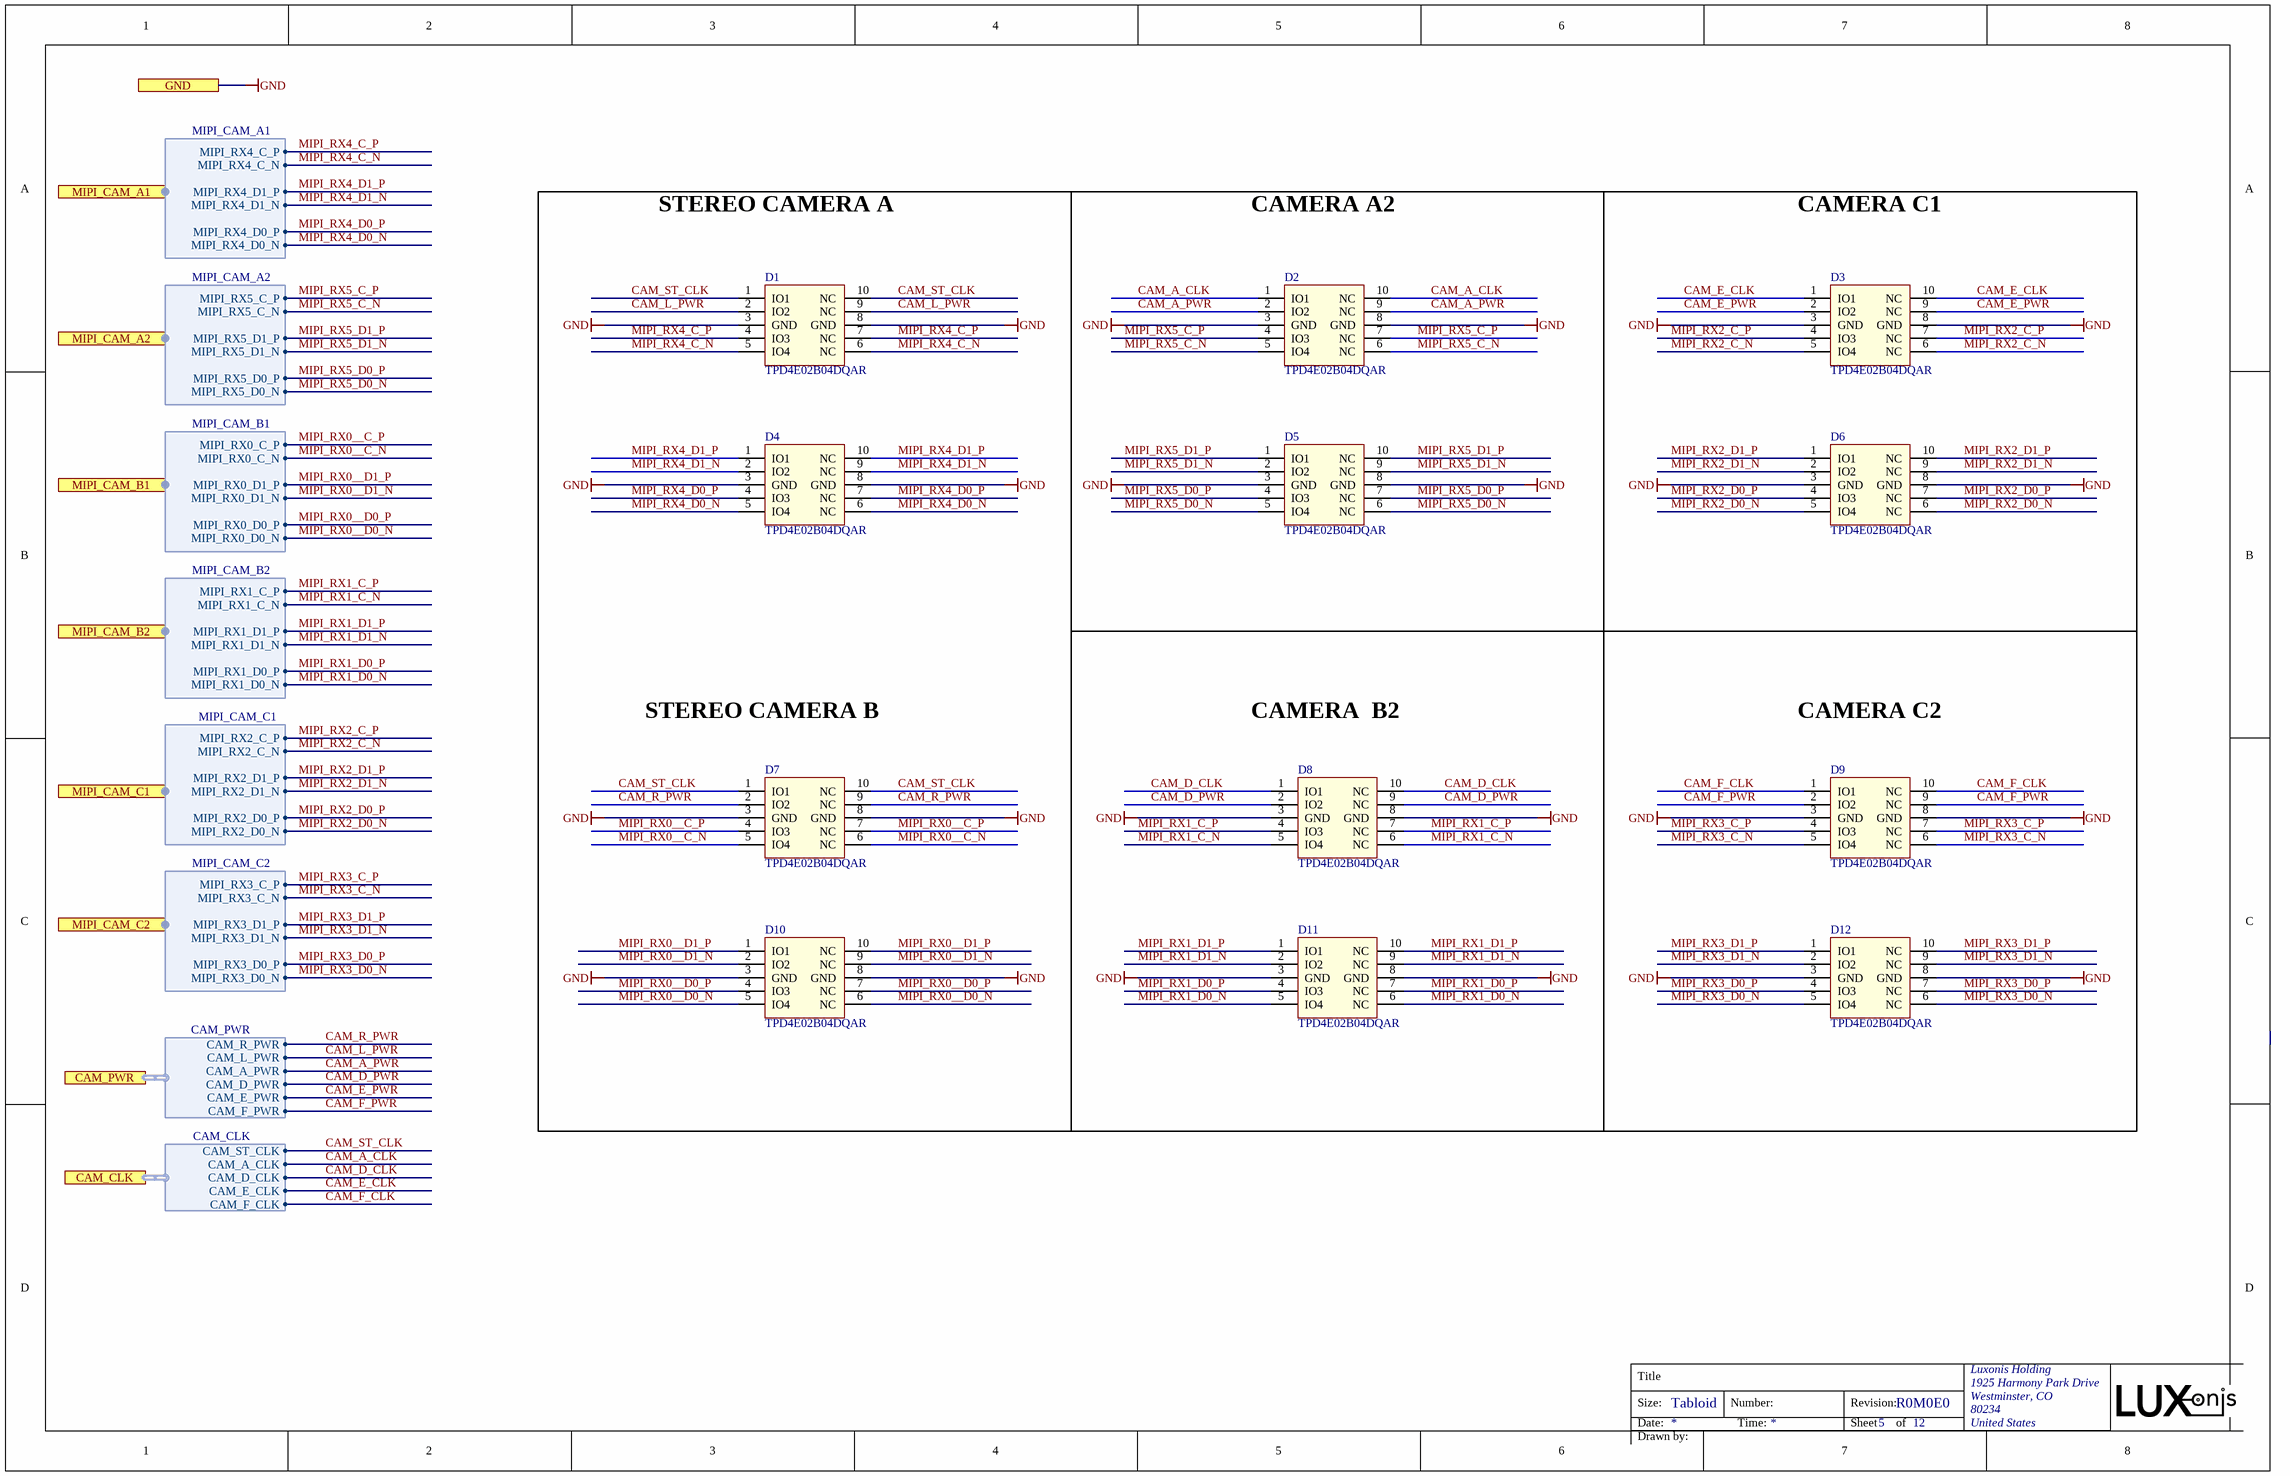
[diagram p6: DM3390_CAM_FFC_ESD_AUX.SchDoc]

### Parts
D1  TPD4E02B04DQAR  [TPD4E02B04DQAR]
D2  TPD4E02B04DQAR  [TPD4E02B04DQAR]
D3  TPD4E02B04DQAR  [TPD4E02B04DQAR]
D4  TPD4E02B04DQAR  [TPD4E02B04DQAR]
D5  TPD4E02B04DQAR  [TPD4E02B04DQAR]
D6  TPD4E02B04DQAR  [TPD4E02B04DQAR]
D7  TPD4E02B04DQAR  [TPD4E02B04DQAR]
D8  TPD4E02B04DQAR  [TPD4E02B04DQAR]
D9  TPD4E02B04DQAR  [TPD4E02B04DQAR]
D10  TPD4E02B04DQAR  [TPD4E02B04DQAR]
D11  TPD4E02B04DQAR  [TPD4E02B04DQAR]
D12  TPD4E02B04DQAR  [TPD4E02B04DQAR]

### Blocks framed on the sheet
CAMERA A2: D2 D5
CAMERA C1: D3 D6
CAMERA  B2: D8 D11
CAMERA C2: D9 D12

### Ports
CAM_CLK (harness CAM_CLK), CAM_PWR (harness CAM_PWR), GND, MIPI_CAM_A1 (harness MIPI_CAM_A1), MIPI_CAM_A2 (harness MIPI_CAM_A2), MIPI_CAM_B1 (harness MIPI_CAM_B1), MIPI_CAM_B2 (harness MIPI_CAM_B2), MIPI_CAM_C1 (harness MIPI_CAM_C1), MIPI_CAM_C2 (harness MIPI_CAM_C2)

### Harnesses
MIPI_CAM_C1: MIPI_RX2_D0_P, MIPI_RX2_D0_N, MIPI_RX2_D1_P, MIPI_RX2_D1_N, MIPI_RX2_C_P, MIPI_RX2_C_N
MIPI_CAM_C2: MIPI_RX3_C_P, MIPI_RX3_C_N, MIPI_RX3_D0_N, MIPI_RX3_D0_P, MIPI_RX3_D1_P, MIPI_RX3_D1_N
MIPI_CAM_B2: MIPI_RX1_D1_P, MIPI_RX1_D1_N, MIPI_RX1_C_P, MIPI_RX1_C_N, MIPI_RX1_D0_P, MIPI_RX1_D0_N
MIPI_CAM_B1: MIPI_RX0_D1_P, MIPI_RX0_D1_N, MIPI_RX0_C_P, MIPI_RX0_C_N, MIPI_RX0_D0_P, MIPI_RX0_D0_N
MIPI_CAM_A1: MIPI_RX4_D1_P, MIPI_RX4_D1_N, MIPI_RX4_C_P, MIPI_RX4_C_N, MIPI_RX4_D0_P, MIPI_RX4_D0_N
MIPI_CAM_A2: MIPI_RX5_D1_P, MIPI_RX5_D1_N, MIPI_RX5_C_P, MIPI_RX5_C_N, MIPI_RX5_D0_P, MIPI_RX5_D0_N
CAM_PWR: CAM_R_PWR, CAM_L_PWR, CAM_A_PWR, CAM_D_PWR, CAM_E_PWR, CAM_F_PWR
CAM_CLK: CAM_ST_CLK, CAM_A_CLK, CAM_D_CLK, CAM_E_CLK, CAM_F_CLK

### Nets
GND: D1.3(GND) D1.8(GND) D2.3(GND) D2.8(GND) D3.3(GND) D3.8(GND) D4.3(GND) D4.8(GND) D5.3(GND) D5.8(GND) D6.3(GND) D6.8(GND) D7.3(GND) D7.8(GND) D8.3(GND) D8.8(GND) D9.3(GND) D9.8(GND) D10.3(GND) D10.8(GND) D11.3(GND) D11.8(GND) D12.3(GND) D12.8(GND) ; port GND
CAM_A_CLK: D2.1(IO1) D2.10(NC) ; port CAM_CLK.CAM_A_CLK
CAM_A_PWR: D2.2(IO2) D2.9(NC) ; port CAM_PWR.CAM_A_PWR
CAM_D_CLK: D8.1(IO1) D8.10(NC) ; port CAM_CLK.CAM_D_CLK
CAM_D_PWR: D8.2(IO2) D8.9(NC) ; port CAM_PWR.CAM_D_PWR
CAM_E_CLK: D3.1(IO1) D3.10(NC) ; port CAM_CLK.CAM_E_CLK
CAM_E_PWR: D3.2(IO2) D3.9(NC) ; port CAM_PWR.CAM_E_PWR
CAM_F_CLK: D9.1(IO1) D9.10(NC) ; port CAM_CLK.CAM_F_CLK
CAM_F_PWR: D9.2(IO2) D9.9(NC) ; port CAM_PWR.CAM_F_PWR
CAM_L_PWR: D1.2(IO2) D1.9(NC) ; port CAM_PWR.CAM_L_PWR
CAM_R_PWR: D7.2(IO2) D7.9(NC) ; port CAM_PWR.CAM_R_PWR
CAM_ST_CLK: D1.1(IO1) D1.10(NC) D7.1(IO1) D7.10(NC) ; port CAM_CLK.CAM_ST_CLK
MIPI_RX0__C_N: D7.5(IO4) D7.6(NC) ; port MIPI_CAM_B1.MIPI_RX0_C_N
MIPI_RX0__C_P: D7.4(IO3) D7.7(NC) ; port MIPI_CAM_B1.MIPI_RX0_C_P
MIPI_RX0__D0_N: D10.5(IO4) D10.6(NC) ; port MIPI_CAM_B1.MIPI_RX0_D0_N
MIPI_RX0__D0_P: D10.4(IO3) D10.7(NC) ; port MIPI_CAM_B1.MIPI_RX0_D0_P
MIPI_RX0__D1_N: D10.2(IO2) D10.9(NC) ; port MIPI_CAM_B1.MIPI_RX0_D1_N
MIPI_RX0__D1_P: D10.1(IO1) D10.10(NC) ; port MIPI_CAM_B1.MIPI_RX0_D1_P
MIPI_RX1_C_N: D8.5(IO4) D8.6(NC) ; port MIPI_CAM_B2.MIPI_RX1_C_N
MIPI_RX1_C_P: D8.4(IO3) D8.7(NC) ; port MIPI_CAM_B2.MIPI_RX1_C_P
MIPI_RX1_D0_N: D11.5(IO4) D11.6(NC) ; port MIPI_CAM_B2.MIPI_RX1_D0_N
MIPI_RX1_D0_P: D11.4(IO3) D11.7(NC) ; port MIPI_CAM_B2.MIPI_RX1_D0_P
MIPI_RX1_D1_N: D11.2(IO2) D11.9(NC) ; port MIPI_CAM_B2.MIPI_RX1_D1_N
MIPI_RX1_D1_P: D11.1(IO1) D11.10(NC) ; port MIPI_CAM_B2.MIPI_RX1_D1_P
MIPI_RX2_C_N: D3.5(IO4) D3.6(NC) ; port MIPI_CAM_C1.MIPI_RX2_C_N
MIPI_RX2_C_P: D3.4(IO3) D3.7(NC) ; port MIPI_CAM_C1.MIPI_RX2_C_P
MIPI_RX2_D0_N: D6.5(IO4) D6.6(NC) ; port MIPI_CAM_C1.MIPI_RX2_D0_N
MIPI_RX2_D0_P: D6.4(IO3) D6.7(NC) ; port MIPI_CAM_C1.MIPI_RX2_D0_P
MIPI_RX2_D1_N: D6.2(IO2) D6.9(NC) ; port MIPI_CAM_C1.MIPI_RX2_D1_N
MIPI_RX2_D1_P: D6.1(IO1) D6.10(NC) ; port MIPI_CAM_C1.MIPI_RX2_D1_P
MIPI_RX3_C_N: D9.5(IO4) D9.6(NC) ; port MIPI_CAM_C2.MIPI_RX3_C_N
MIPI_RX3_C_P: D9.4(IO3) D9.7(NC) ; port MIPI_CAM_C2.MIPI_RX3_C_P
MIPI_RX3_D0_N: D12.5(IO4) D12.6(NC) ; port MIPI_CAM_C2.MIPI_RX3_D0_N
MIPI_RX3_D0_P: D12.4(IO3) D12.7(NC) ; port MIPI_CAM_C2.MIPI_RX3_D0_P
MIPI_RX3_D1_N: D12.2(IO2) D12.9(NC) ; port MIPI_CAM_C2.MIPI_RX3_D1_N
MIPI_RX3_D1_P: D12.1(IO1) D12.10(NC) ; port MIPI_CAM_C2.MIPI_RX3_D1_P
MIPI_RX4_C_N: D1.5(IO4) D1.6(NC) ; port MIPI_CAM_A1.MIPI_RX4_C_N
MIPI_RX4_C_P: D1.4(IO3) D1.7(NC) ; port MIPI_CAM_A1.MIPI_RX4_C_P
MIPI_RX4_D0_N: D4.5(IO4) D4.6(NC) ; port MIPI_CAM_A1.MIPI_RX4_D0_N
MIPI_RX4_D0_P: D4.4(IO3) D4.7(NC) ; port MIPI_CAM_A1.MIPI_RX4_D0_P
MIPI_RX4_D1_N: D4.2(IO2) D4.9(NC) ; port MIPI_CAM_A1.MIPI_RX4_D1_N
MIPI_RX4_D1_P: D4.1(IO1) D4.10(NC) ; port MIPI_CAM_A1.MIPI_RX4_D1_P
MIPI_RX5_C_N: D2.5(IO4) D2.6(NC) ; port MIPI_CAM_A2.MIPI_RX5_C_N
MIPI_RX5_C_P: D2.4(IO3) D2.7(NC) ; port MIPI_CAM_A2.MIPI_RX5_C_P
MIPI_RX5_D0_N: D5.5(IO4) D5.6(NC) ; port MIPI_CAM_A2.MIPI_RX5_D0_N
MIPI_RX5_D0_P: D5.4(IO3) D5.7(NC) ; port MIPI_CAM_A2.MIPI_RX5_D0_P
MIPI_RX5_D1_N: D5.2(IO2) D5.9(NC) ; port MIPI_CAM_A2.MIPI_RX5_D1_N
MIPI_RX5_D1_P: D5.1(IO1) D5.10(NC) ; port MIPI_CAM_A2.MIPI_RX5_D1_P

### Notes on the sheet
- STEREO CAMERA A
- STEREO CAMERA B
- Title
- Size:
- Date:
- Tabloid
- Number:
- Time:
- Revision:
- Sheet
- of
- Drawn by:

### Library data of the parts
D1-D12 = TPD4E02B04DQAR: TVS DIODE 3.6V 8.8V 10USON 8.8V (Typ) Clamp 5A (8/20µs) Ipp Tvs Diode Surface Mount 10-USON (2.5x1); Manufacturer 1: Texas Instruments; Number of Bidirectional Channels: 4; Min Breakdown Voltage: 5.5V; Peak Pulse Power: 17W; Power Line Protection: No; Interface: USB,HDMI; Supplier 1: Digi-Key; Manufacturer Part Number 1: TPD4E02B04DQAR; Stock 1: 25615; Pricing 1: 1=0.69000, 10=0.60800, 100=0.46650, 500=0.36874, 1000=0.29499 (USD); RoHS: Yes; Mount: Surface Mount; Number of Pins: 10; Min Operating Temperature: -40°C; Max Operating Temperature: 125°C; Packaging: Cut Tape; Reverse Standoff Voltage: 3.6V; Clamping Voltage: 8.8V; Operating Supply Voltage: 3.6V; Peak Pulse Current: 5A; Number of Channels: 4; Composition: Zener; REACH SVHC: No SVHC; Lead Free: Lead Free; ComponentLink1URL: http://www.ti.com/general/docs/lit/getliterature.tsp?genericPartNumber=TPD4E02B04&amp;&amp;fileType=pdf&src-supplier=Element14; ComponentLink1Description: http://www.ti.com/general/docs/lit/getliterature.tsp?genericPartNumber=TPD4E02B04&amp;&amp;fileType=pdf&src-supplier=Element14; ComponentLink2URL: http://www.ti.com/lit/ds/symlink/tpd4e02b04.pdf?src-supplier=Farnell; ComponentLink2Description: http://www.ti.com/lit/ds/symlink/tpd4e02b04.pdf?src-supplier=Farnell; ComponentLink3URL: http://www.ti.com/lit/ds/symlink/tpd4e02b04.pdf?src-supplier=Newark; ComponentLink3Description: http://www.ti.com/lit/ds/symlink/tpd4e02b04.pdf?src-supplier=Newark; ComponentLink4URL: http://www.ti.com/lit/ds/symlink/tpd4e02b04.pdf?src-supplier=Digi-Key; ComponentLink4Description: http://www.ti.com/lit/ds/symlink/tpd4e02b04.pdf?src-supplier=Digi-Key; Supplier Part Number 1: 296-43875-1-ND